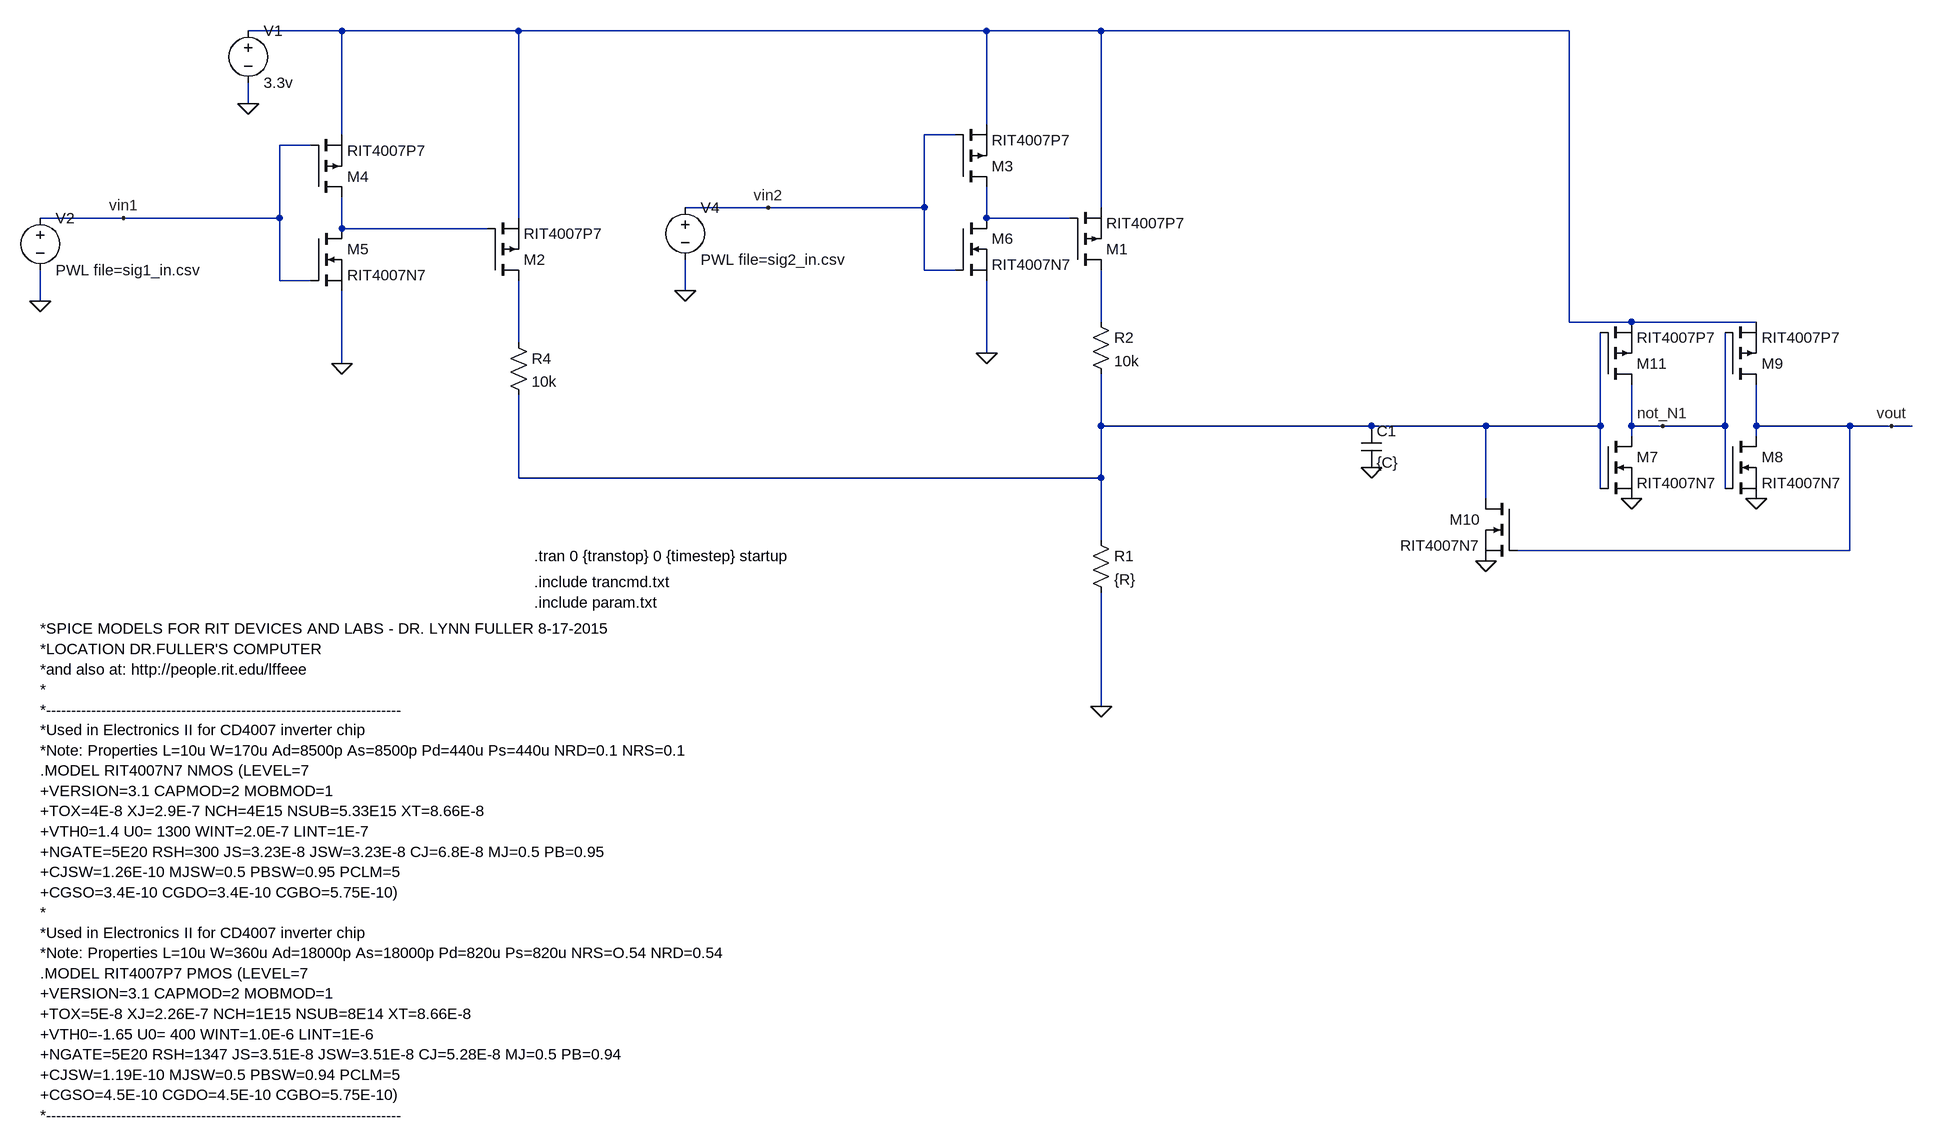
[diagram p0: schematic 2expsynapse1.asc]
2expsynapse1.asc, the LTspice schematic file:
Version 4
SHEET 1 1972 1144
WIRE -896 -464 -1040 -464
WIRE -624 -464 -896 -464
WIRE 96 -464 -624 -464
WIRE 272 -464 96 -464
WIRE 992 -464 272 -464
WIRE -1040 -352 -1040 -384
WIRE 96 -320 96 -464
WIRE -896 -304 -896 -464
WIRE 48 -304 0 -304
WIRE -944 -288 -992 -288
WIRE -240 -192 -368 -192
WIRE 0 -192 0 -304
WIRE 0 -192 -240 -192
WIRE 272 -192 272 -464
WIRE -1232 -176 -1360 -176
WIRE -992 -176 -992 -288
WIRE -992 -176 -1232 -176
WIRE -624 -176 -624 -464
WIRE 96 -176 96 -224
WIRE 224 -176 96 -176
WIRE -896 -160 -896 -208
WIRE -672 -160 -896 -160
WIRE 0 -96 0 -192
WIRE 48 -96 0 -96
WIRE -992 -80 -992 -176
WIRE -944 -80 -992 -80
WIRE -368 -64 -368 -112
WIRE -1360 -48 -1360 -96
WIRE 272 -16 272 -96
WIRE 992 -16 992 -464
WIRE 1088 -16 992 -16
WIRE 1280 -16 1088 -16
WIRE -624 16 -624 -80
WIRE 96 32 96 -80
WIRE -896 48 -896 -64
WIRE 272 144 272 64
WIRE 688 144 272 144
WIRE 864 144 688 144
WIRE 1040 144 1040 0
WIRE 1040 144 864 144
WIRE 1088 144 1088 80
WIRE 1136 144 1088 144
WIRE 1232 144 1232 0
WIRE 1232 144 1136 144
WIRE 1280 144 1280 80
WIRE 1424 144 1280 144
WIRE 1488 144 1424 144
WIRE 1520 144 1488 144
WIRE 1088 160 1088 144
WIRE 1280 160 1280 144
WIRE -624 224 -624 96
WIRE 272 224 272 144
WIRE 272 224 -624 224
WIRE 1040 240 1040 144
WIRE 1232 240 1232 144
WIRE 864 256 864 144
WIRE 272 320 272 224
WIRE 1424 336 1424 144
WIRE 1424 336 912 336
WIRE 272 576 272 400
FLAG 272 576 0
FLAG -896 48 0
FLAG -1360 -48 0
FLAG -1232 -176 vin1
FLAG -1040 -352 0
FLAG 96 32 0
FLAG -368 -64 0
FLAG -240 -192 vin2
FLAG 864 352 0
FLAG 1088 256 0
FLAG 1280 256 0
FLAG 688 208 0
FLAG 1136 144 not_N1
FLAG 1488 144 vout
SYMBOL pmos 224 -96 M180
SYMATTR InstName M1
SYMATTR Value RIT4007P7
SYMBOL res 256 304 R0
SYMATTR InstName R1
SYMATTR Value {R}
SYMBOL pmos -672 -80 M180
SYMATTR InstName M2
SYMATTR Value RIT4007P7
SYMBOL voltage -1040 -480 R0
WINDOW 123 0 0 Left 0
WINDOW 39 0 0 Left 0
SYMATTR InstName V1
SYMATTR Value 3.3v
SYMBOL pmos -944 -208 M180
SYMATTR InstName M4
SYMATTR Value RIT4007P7
SYMBOL nmos -944 -160 R0
SYMATTR InstName M5
SYMATTR Value RIT4007N7
SYMBOL voltage -1360 -192 R0
WINDOW 39 0 0 Left 0
WINDOW 123 0 0 Left 0
SYMATTR InstName V2
SYMATTR Value PWL file=sig1_in.csv
SYMBOL pmos 48 -224 M180
SYMATTR InstName M3
SYMATTR Value RIT4007P7
SYMBOL nmos 48 -176 R0
SYMATTR InstName M6
SYMATTR Value RIT4007N7
SYMBOL voltage -368 -208 R0
WINDOW 39 0 0 Left 0
WINDOW 123 0 0 Left 0
SYMATTR InstName V4
SYMATTR Value PWL file=sig2_in.csv
SYMBOL nmos 1040 160 R0
SYMATTR InstName M7
SYMATTR Value RIT4007N7
SYMBOL nmos 1232 160 R0
SYMATTR InstName M8
SYMATTR Value RIT4007N7
SYMBOL pmos 1232 80 M180
SYMATTR InstName M9
SYMATTR Value RIT4007P7
SYMBOL nmos 912 256 M0
SYMATTR InstName M10
SYMATTR Value RIT4007N7
SYMBOL cap 672 144 R0
SYMATTR InstName C1
SYMATTR Value {C}
SYMBOL pmos 1040 80 M180
SYMATTR InstName M11
SYMATTR Value RIT4007P7
SYMBOL res 256 -32 R0
SYMATTR InstName R2
SYMATTR Value 10k
SYMBOL res -640 0 R0
SYMATTR InstName R4
SYMATTR Value 10k
TEXT -600 344 Left 2 !.tran 0 {transtop} 0 {timestep} startup
TEXT -600 384 Left 2 !.include trancmd.txt
TEXT -1360 456 Left 2 !*SPICE MODELS FOR RIT DEVICES AND LABS - DR. LYNN FULLER 8-17-2015\n*LOCATION DR.FULLER'S COMPUTER\n*and also at: http://people.rit.edu/lffeee\n*\n*-----------------------------------------------------------------------\n*Used in Electronics II for CD4007 inverter chip\n*Note: Properties L=10u W=170u Ad=8500p As=8500p Pd=440u Ps=440u NRD=0.1 NRS=0.1\n.MODEL RIT4007N7 NMOS (LEVEL=7\n+VERSION=3.1 CAPMOD=2 MOBMOD=1\n+TOX=4E-8 XJ=2.9E-7 NCH=4E15 NSUB=5.33E15 XT=8.66E-8\n+VTH0=1.4 U0= 1300 WINT=2.0E-7 LINT=1E-7\n+NGATE=5E20 RSH=300 JS=3.23E-8 JSW=3.23E-8 CJ=6.8E-8 MJ=0.5 PB=0.95\n+CJSW=1.26E-10 MJSW=0.5 PBSW=0.95 PCLM=5\n+CGSO=3.4E-10 CGDO=3.4E-10 CGBO=5.75E-10)\n*\n*Used in Electronics II for CD4007 inverter chip\n*Note: Properties L=10u W=360u Ad=18000p As=18000p Pd=820u Ps=820u NRS=O.54 NRD=0.54\n.MODEL RIT4007P7 PMOS (LEVEL=7\n+VERSION=3.1 CAPMOD=2 MOBMOD=1\n+TOX=5E-8 XJ=2.26E-7 NCH=1E15 NSUB=8E14 XT=8.66E-8\n+VTH0=-1.65 U0= 400 WINT=1.0E-6 LINT=1E-6\n+NGATE=5E20 RSH=1347 JS=3.51E-8 JSW=3.51E-8 CJ=5.28E-8 MJ=0.5 PB=0.94\n+CJSW=1.19E-10 MJSW=0.5 PBSW=0.94 PCLM=5\n+CGSO=4.5E-10 CGDO=4.5E-10 CGBO=5.75E-10)\n*-----------------------------------------------------------------------
TEXT -600 416 Left 2 !.include param.txt

The netlist it stands for:
* 2expsynapse1.asc
M1 N004 N002 N001 N001 RIT4007P7
R1 N006 0 {R}
M2 N005 N003 N001 N001 RIT4007P7
V1 N001 0 3.3v
M4 N003 vin1 N001 N001 RIT4007P7
M5 N003 vin1 0 0 RIT4007N7
V2 vin1 0 PWL file=sig1_in.csv
M3 N002 vin2 N001 N001 RIT4007P7
M6 N002 vin2 0 0 RIT4007N7
V4 vin2 0 PWL file=sig2_in.csv
M7 not_N1 N006 0 0 RIT4007N7
M8 vout not_N1 0 0 RIT4007N7
M9 vout not_N1 N001 N001 RIT4007P7
M10 N006 vout 0 0 RIT4007N7
C1 N006 0 {C}
M11 not_N1 N006 N001 N001 RIT4007P7
R2 N004 N006 10k
R4 N005 N006 10k
.model NMOS NMOS
.model PMOS PMOS
.lib standard.mos
.tran 0 {transtop} 0 {timestep} startup
.include trancmd.txt
*SPICE MODELS FOR RIT DEVICES AND LABS - DR. LYNN FULLER 8-17-2015
*LOCATION DR.FULLER'S COMPUTER
*and also at: http://people.rit.edu/lffeee
*
*-----------------------------------------------------------------------
*Used in Electronics II for CD4007 inverter chip
*Note: Properties L=10u W=170u Ad=8500p As=8500p Pd=440u Ps=440u NRD=0.1 NRS=0.1
.MODEL RIT4007N7 NMOS (LEVEL=7
+VERSION=3.1 CAPMOD=2 MOBMOD=1
+TOX=4E-8 XJ=2.9E-7 NCH=4E15 NSUB=5.33E15 XT=8.66E-8
+VTH0=1.4 U0= 1300 WINT=2.0E-7 LINT=1E-7
+NGATE=5E20 RSH=300 JS=3.23E-8 JSW=3.23E-8 CJ=6.8E-8 MJ=0.5 PB=0.95
+CJSW=1.26E-10 MJSW=0.5 PBSW=0.95 PCLM=5
+CGSO=3.4E-10 CGDO=3.4E-10 CGBO=5.75E-10)
*
*Used in Electronics II for CD4007 inverter chip
*Note: Properties L=10u W=360u Ad=18000p As=18000p Pd=820u Ps=820u NRS=O.54 NRD=0.54
.MODEL RIT4007P7 PMOS (LEVEL=7
+VERSION=3.1 CAPMOD=2 MOBMOD=1
+TOX=5E-8 XJ=2.26E-7 NCH=1E15 NSUB=8E14 XT=8.66E-8
+VTH0=-1.65 U0= 400 WINT=1.0E-6 LINT=1E-6
+NGATE=5E20 RSH=1347 JS=3.51E-8 JSW=3.51E-8 CJ=5.28E-8 MJ=0.5 PB=0.94
+CJSW=1.19E-10 MJSW=0.5 PBSW=0.94 PCLM=5
+CGSO=4.5E-10 CGDO=4.5E-10 CGBO=5.75E-10)
*-----------------------------------------------------------------------
.include param.txt
.backanno
.end